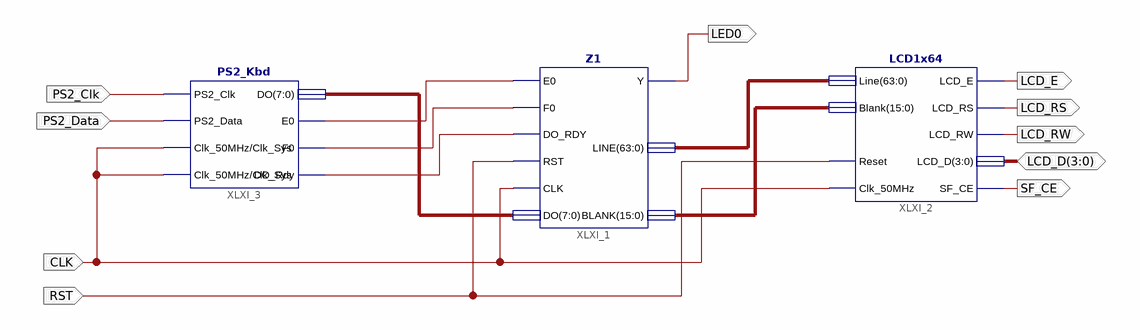
[diagram p0: schematic sheet 1]
// Xilinx ISE schematic Z1schemat.sch (spartan3e) as structural Verilog: 3 symbols, 10 ports
module Z1schemat (
  input  RST,
  input  PS2_Clk,
  input  PS2_Data,
  input  CLK,
  inout  [3:0] LCD_D,
  output LED0,
  output LCD_E,
  output LCD_RS,
  output LCD_RW,
  output SF_CE
);

  wire XLXN_2, XLXN_3, XLXN_4;
  wire [7:0] XLXN_1;
  wire [15:0] XLXN_7;
  wire [63:0] XLXN_6;

  Z1 XLXI_1 (
    .E0(XLXN_2), .F0(XLXN_3), .DO_RDY(XLXN_4), .RST(RST), .CLK(CLK), .DO(XLXN_1), .Y(LED0), .LINE(XLXN_6),
    .BLANK(XLXN_7));
  LCD1x64 XLXI_2 (
    .Clk_50MHz(CLK), .Reset(RST), .Line(XLXN_6), .Blank(XLXN_7), .LCD_D(LCD_D), .LCD_E(LCD_E),
    .LCD_RW(LCD_RW), .LCD_RS(LCD_RS), .SF_CE(SF_CE));
  PS2_Kbd XLXI_3 (
    .PS2_Clk(PS2_Clk), .PS2_Data(PS2_Data), .Clk_50MHz(CLK), .E0(XLXN_2), .F0(XLXN_3), .DO_Rdy(XLXN_4),
    .DO(XLXN_1), .Clk_Sys(CLK));
endmodule
